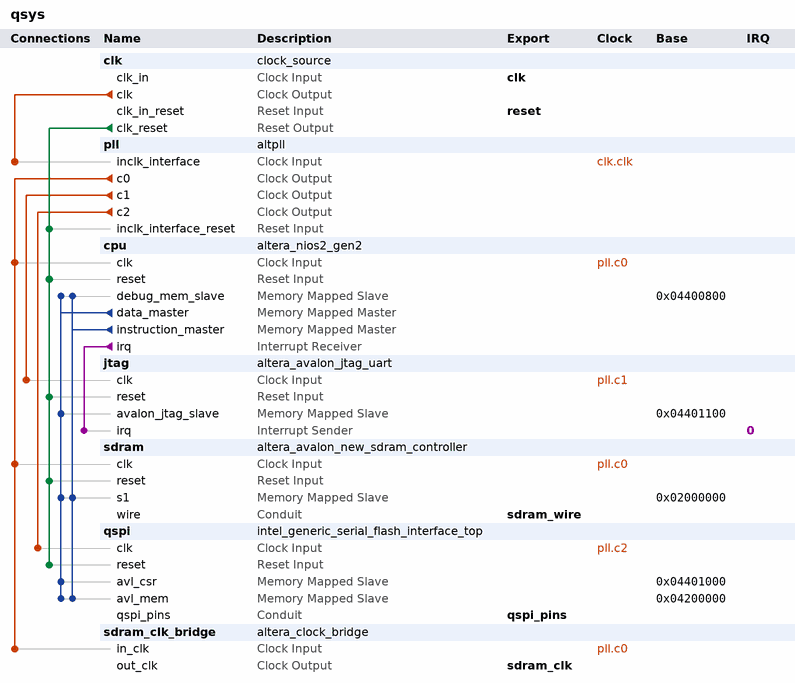
[diagram p0: system contents]
# Platform Designer (Qsys) system qsys, MAX 10 10M25DCF256C8G
# Parameters at their usual value, and those the tool derives, are not listed.
package require -exact qsys 18.1
create_system qsys
set_project_property DEVICE_FAMILY {MAX 10}
set_project_property DEVICE 10M25DCF256C8G

add_instance clk clock_source 18.1
set_instance_parameter_value clk clockFrequency 50000000

add_instance pll altpll 18.1
set_instance_parameter_value pll CLK0_DIVIDE_BY 1
set_instance_parameter_value pll CLK0_MULTIPLY_BY 1
set_instance_parameter_value pll CLK1_DIVIDE_BY 1
set_instance_parameter_value pll CLK1_DUTY_CYCLE 50
set_instance_parameter_value pll CLK1_MULTIPLY_BY 1
set_instance_parameter_value pll CLK1_PHASE_SHIFT 0
set_instance_parameter_value pll CLK2_DIVIDE_BY 4
set_instance_parameter_value pll CLK2_DUTY_CYCLE 50
set_instance_parameter_value pll CLK2_MULTIPLY_BY 1
set_instance_parameter_value pll CLK2_PHASE_SHIFT 0
set_instance_parameter_value pll INCLK0_INPUT_FREQUENCY 10000
set_instance_parameter_value pll PORT_ARESET PORT_UNUSED
set_instance_parameter_value pll PORT_LOCKED PORT_UNUSED
set_instance_parameter_value pll PORT_clk1 PORT_USED
set_instance_parameter_value pll PORT_clk2 PORT_USED
set_instance_parameter_value pll PORT_clk3 PORT_UNUSED

add_instance cpu altera_nios2_gen2 18.1
set_instance_parameter_value cpu dcache_size 2048
set_instance_parameter_value cpu exceptionSlave sdram.s1
set_instance_parameter_value cpu icache_size 4096
set_instance_parameter_value cpu impl Fast
set_instance_parameter_value cpu resetSlave sdram.s1

add_instance jtag altera_avalon_jtag_uart 18.1
set_instance_parameter_value jtag simInteractiveOptions NO_INTERACTIVE_WINDOWS

add_instance sdram altera_avalon_new_sdram_controller 18.1
set_instance_parameter_value sdram TAC 5.5
set_instance_parameter_value sdram TRCD 20.0
set_instance_parameter_value sdram TRP 20.0
set_instance_parameter_value sdram casLatency 3
set_instance_parameter_value sdram columnWidth 9
set_instance_parameter_value sdram dataWidth 16
set_instance_parameter_value sdram generateSimulationModel false
set_instance_parameter_value sdram model single_Micron_MT48LC4M32B2_7_chip
set_instance_parameter_value sdram numberOfBanks 4
set_instance_parameter_value sdram numberOfChipSelects 1
set_instance_parameter_value sdram powerUpDelay 100.0
set_instance_parameter_value sdram refreshPeriod 15.625
set_instance_parameter_value sdram rowWidth 13

add_instance qspi intel_generic_serial_flash_interface_top 18.1
set_instance_parameter_value qspi CHIP_SELECT_BYPASS false
set_instance_parameter_value qspi CHIP_SELS 1
set_instance_parameter_value qspi DEBUG_OPTION 0
set_instance_parameter_value qspi DEFAULT_VALUE_REG_0 1
set_instance_parameter_value qspi DEFAULT_VALUE_REG_1 16
set_instance_parameter_value qspi DEFAULT_VALUE_REG_2 0
set_instance_parameter_value qspi DEFAULT_VALUE_REG_3 0
set_instance_parameter_value qspi DEFAULT_VALUE_REG_4 0
set_instance_parameter_value qspi DEFAULT_VALUE_REG_5 3
set_instance_parameter_value qspi DEFAULT_VALUE_REG_6 28674
set_instance_parameter_value qspi DEFAULT_VALUE_REG_7 6149
set_instance_parameter_value qspi DEVICE_DENSITY 16
set_instance_parameter_value qspi ENABLE_SIM_MODEL false
set_instance_parameter_value qspi PIPE_CMD_GEN_CMD 0
set_instance_parameter_value qspi PIPE_CSR 0
set_instance_parameter_value qspi PIPE_MUX_CMD 0
set_instance_parameter_value qspi PIPE_XIP 0
set_instance_parameter_value qspi USE_CHIP_SEL_FROM_CSR 1
set_instance_parameter_value qspi gui_use_asmiblock true
set_instance_parameter_value qspi gui_use_gpio true

add_instance sdram_clk_bridge altera_clock_bridge 18.1
set_instance_parameter_value sdram_clk_bridge DERIVED_CLOCK_RATE 100000000
set_instance_parameter_value sdram_clk_bridge EXPLICIT_CLOCK_RATE 25000000

# connections
add_connection clk.clk pll.inclk_interface clock
add_connection pll.c0 cpu.clk clock
add_connection pll.c0 sdram.clk clock
add_connection pll.c0 sdram_clk_bridge.in_clk clock
add_connection pll.c1 jtag.clk clock
add_connection pll.c2 qspi.clk clock
add_connection clk.clk_reset cpu.reset reset
add_connection clk.clk_reset jtag.reset reset
add_connection clk.clk_reset pll.inclk_interface_reset reset
add_connection clk.clk_reset qspi.reset reset
add_connection clk.clk_reset sdram.reset reset
add_connection cpu.data_master cpu.debug_mem_slave avalon
set_connection_parameter_value cpu.data_master/cpu.debug_mem_slave baseAddress 0x04400800
add_connection cpu.data_master jtag.avalon_jtag_slave avalon
set_connection_parameter_value cpu.data_master/jtag.avalon_jtag_slave baseAddress 0x04401100
add_connection cpu.data_master qspi.avl_csr avalon
set_connection_parameter_value cpu.data_master/qspi.avl_csr baseAddress 0x04401000
add_connection cpu.data_master qspi.avl_mem avalon
set_connection_parameter_value cpu.data_master/qspi.avl_mem baseAddress 0x04200000
add_connection cpu.data_master sdram.s1 avalon
set_connection_parameter_value cpu.data_master/sdram.s1 baseAddress 0x02000000
add_connection cpu.instruction_master cpu.debug_mem_slave avalon
set_connection_parameter_value cpu.instruction_master/cpu.debug_mem_slave baseAddress 0x04400800
add_connection cpu.instruction_master qspi.avl_mem avalon
set_connection_parameter_value cpu.instruction_master/qspi.avl_mem baseAddress 0x04200000
add_connection cpu.instruction_master sdram.s1 avalon
set_connection_parameter_value cpu.instruction_master/sdram.s1 baseAddress 0x02000000
add_connection cpu.irq jtag.irq interrupt
set_connection_parameter_value cpu.irq/jtag.irq irqNumber 0

# exported interfaces
add_interface clk clock sink
set_interface_property clk EXPORT_OF clk.clk_in
add_interface qspi_pins conduit end
set_interface_property qspi_pins EXPORT_OF qspi.qspi_pins
add_interface reset reset sink
set_interface_property reset EXPORT_OF clk.clk_in_reset
add_interface sdram_clk clock source
set_interface_property sdram_clk EXPORT_OF sdram_clk_bridge.out_clk
add_interface sdram_wire conduit end
set_interface_property sdram_wire EXPORT_OF sdram.wire

set_interconnect_requirement {$system} qsys_mm.clockCrossingAdapter HANDSHAKE
set_interconnect_requirement {$system} qsys_mm.enableEccProtection FALSE
set_interconnect_requirement {$system} qsys_mm.insertDefaultSlave FALSE
set_interconnect_requirement {$system} qsys_mm.maxAdditionalLatency 1

save_system qsys.qsys
